# EAGLE design M121B (EAGLE 6.6.0)
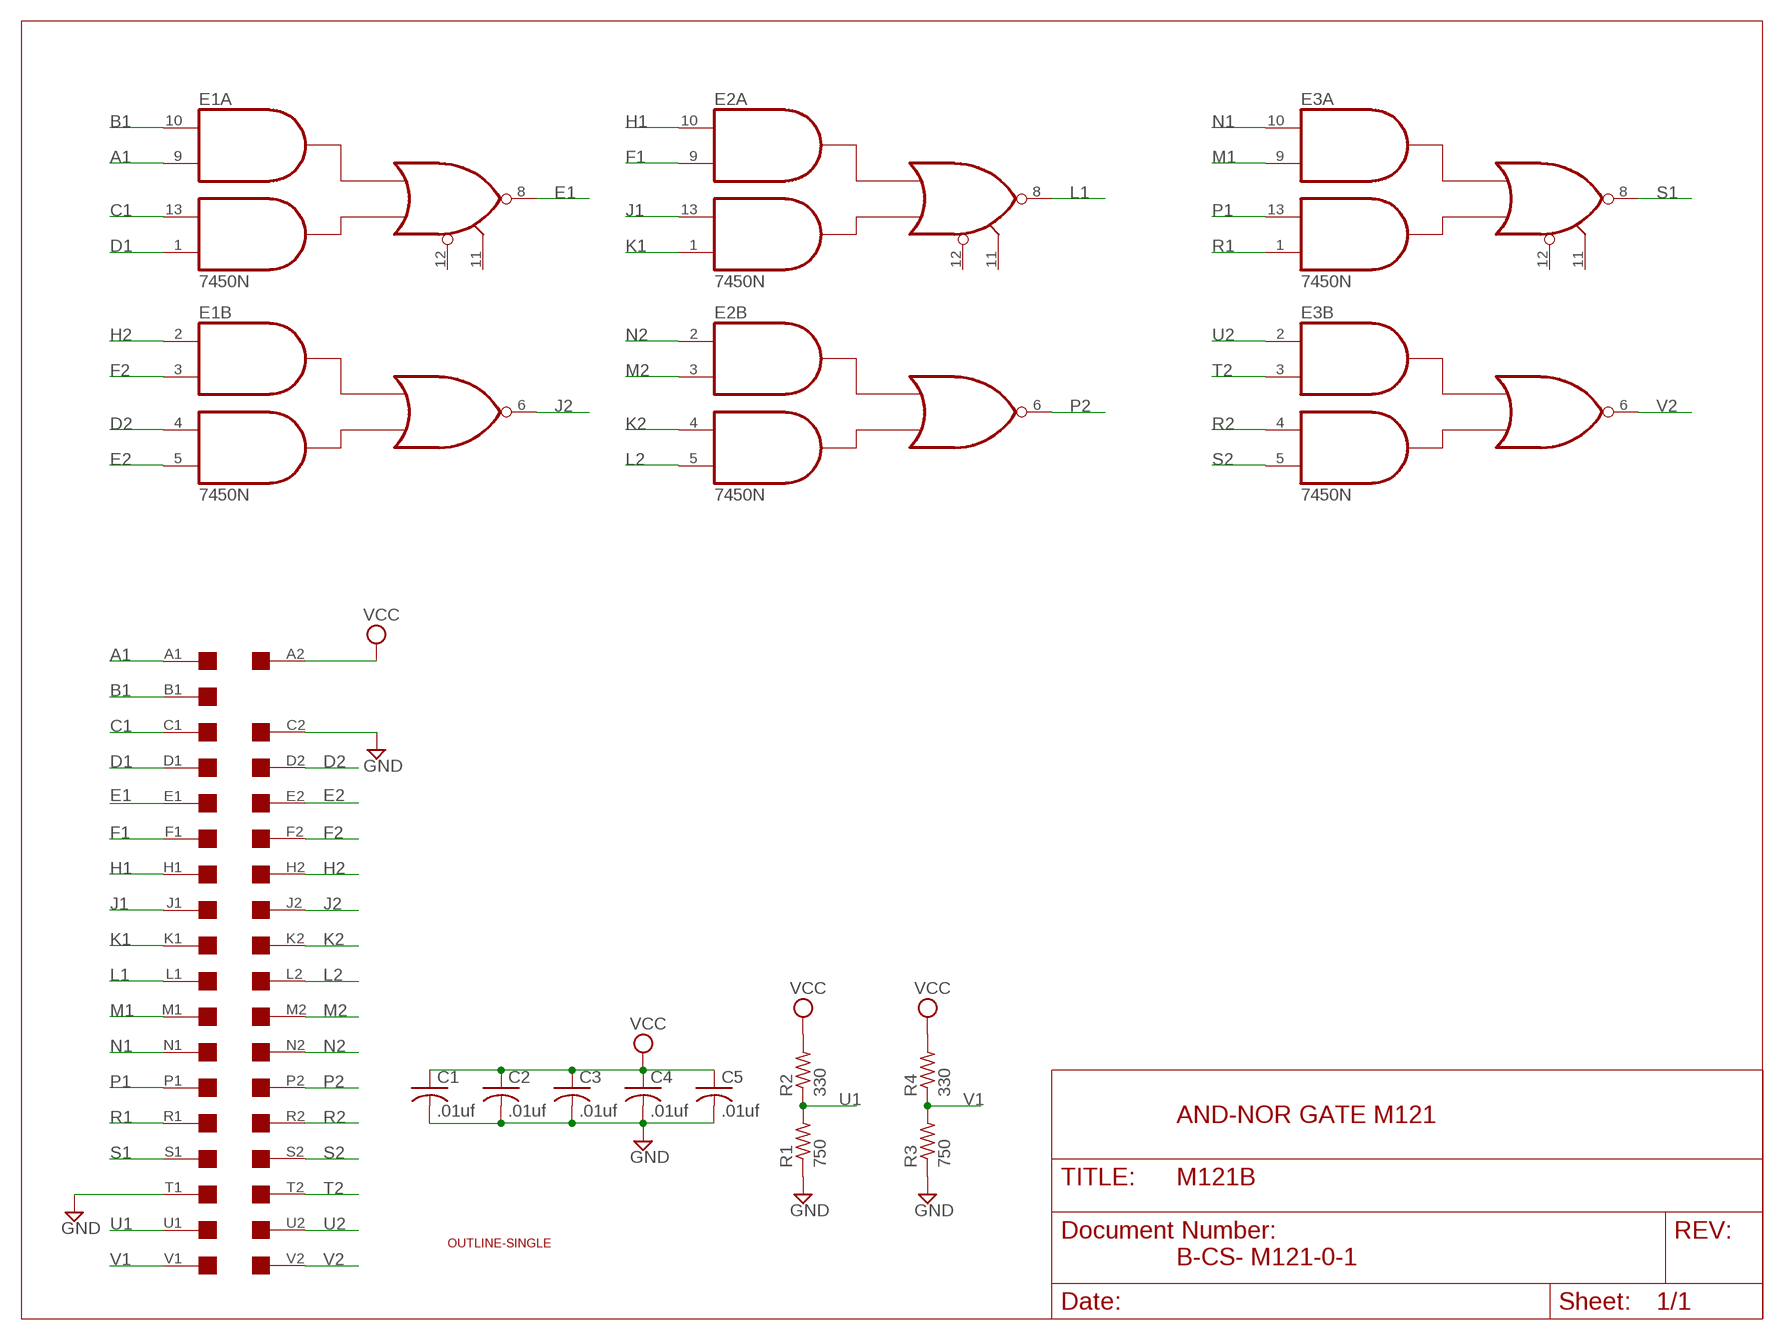
[diagram p0: schematic, sheet 1]

## Parts
C1  .01uf  C-US050-025X075  [C050-025X075]
C2  .01uf  C-US050-025X075  [C050-025X075]
C3  .01uf  C-US050-025X075  [C050-025X075]
C4  .01uf  C-US050-025X075  [C050-025X075]
C5  .01uf  C-US050-025X075  [C050-025X075]
E1  7450N  [DIL14]
E2  7450N  [DIL14]
E3  7450N  [DIL14]
R1  750  R-US_0207/10  [0207/10]
R2  330  R-US_0207/10  [0207/10]
R3  750  R-US_0207/10  [0207/10]
R4  330  R-US_0207/10  [0207/10]
U$1  OUTLINE-SINGLE  [SINGLE]
U$4  SINGLE  [EDGE-CON2]

## Nets
A1: E1.9(A:I2) U$4.A1
B1: E1.10(A:I1) U$4.B1
C1: E1.13(A:I3) U$4.C1
D1: E1.1(A:I4) U$4.D1
D2: E1.4(B:I3) U$4.D2
E1: E1.8(A:O) U$4.E1
E2: E1.5(B:I4) U$4.E2
F1: E2.9(A:I2) U$4.F1
F2: E1.3(B:I2) U$4.F2
GND [Supply]: C1.2 C2.2 C3.2 C4.2 C5.2 R1.1 R3.1 U$4.C2 U$4.T1
H1: E2.10(A:I1) U$4.H1
H2: E1.2(B:I1) U$4.H2
J1: E2.13(A:I3) U$4.J1
J2: E1.6(B:O) U$4.J2
K1: E2.1(A:I4) U$4.K1
K2: E2.4(B:I3) U$4.K2
L1: E2.8(A:O) U$4.L1
L2: E2.5(B:I4) U$4.L2
M1: E3.9(A:I2) U$4.M1
M2: E2.3(B:I2) U$4.M2
N1: E3.10(A:I1) U$4.N1
N2: E2.2(B:I1) U$4.N2
P1: E3.13(A:I3) U$4.P1
P2: E2.6(B:O) U$4.P2
R1: E3.1(A:I4) U$4.R1
R2: E3.4(B:I3) U$4.R2
S1: E3.8(A:O) U$4.S1
S2: E3.5(B:I4) U$4.S2
T2: E3.3(B:I2) U$4.T2
U1: R1.2 R2.1 U$4.U1
U2: E3.2(B:I1) U$4.U2
V1: R3.2 R4.1 U$4.V1
V2: E3.6(B:O) U$4.V2
VCC [Supply]: C1.1 C2.1 C3.1 C4.1 C5.1 R2.2 R4.2 U$4.A2
Unconnected: E1.11(A:I6) E1.12(A:I5) E2.11(A:I6) E2.12(A:I5) E3.11(A:I6) E3.12(A:I5) U$4.B2

## Notes on the sheet
- AND-NOR GATE M121
- B-CS- M121-0-1

## Power pins joined to a net without a drawn wire
GND: E1.7(P:GND) E2.7(P:GND) E3.7(P:GND)
VCC: E1.14(P:VCC) E2.14(P:VCC) E3.14(P:VCC)

## Library data of the parts
C1-C5 = rcl:C-US: CAPACITOR, American symbol
E1-E3 = dec-con:74*50: 4-2-3-2 input AND OR INVERTER gates
R1-R4 = rcl:R-US_: RESISTOR, American symbol
U$1 = dec-con:OUTLINE-*: Board outlines for DEC boards.
U$4 = dec-con:SINGLE: Single-Height DEC board

## Net classes
1 Supply: width 0.813 mm

## Board
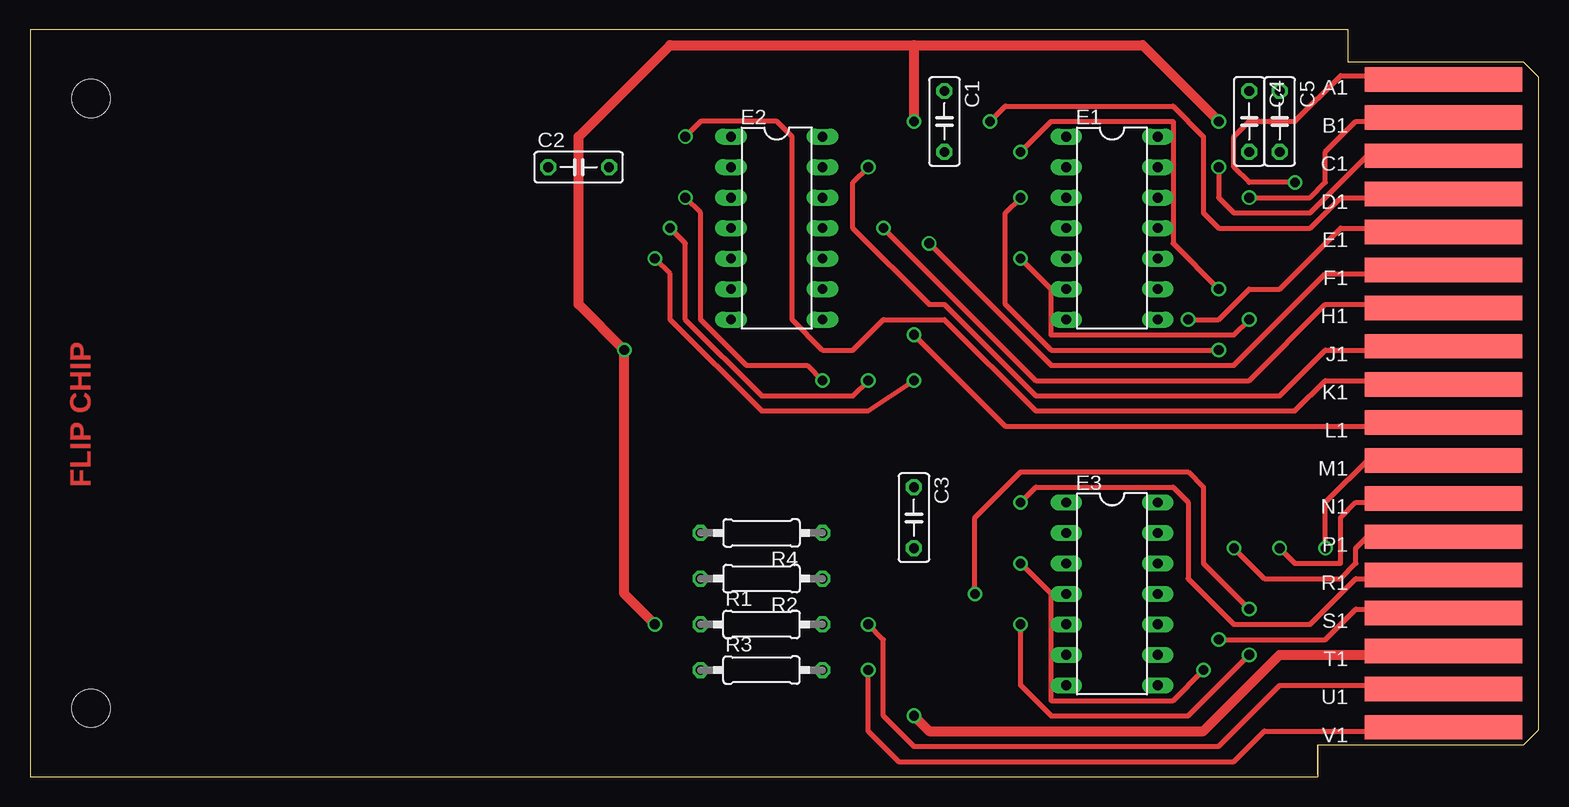
[diagram p1: board, top side]
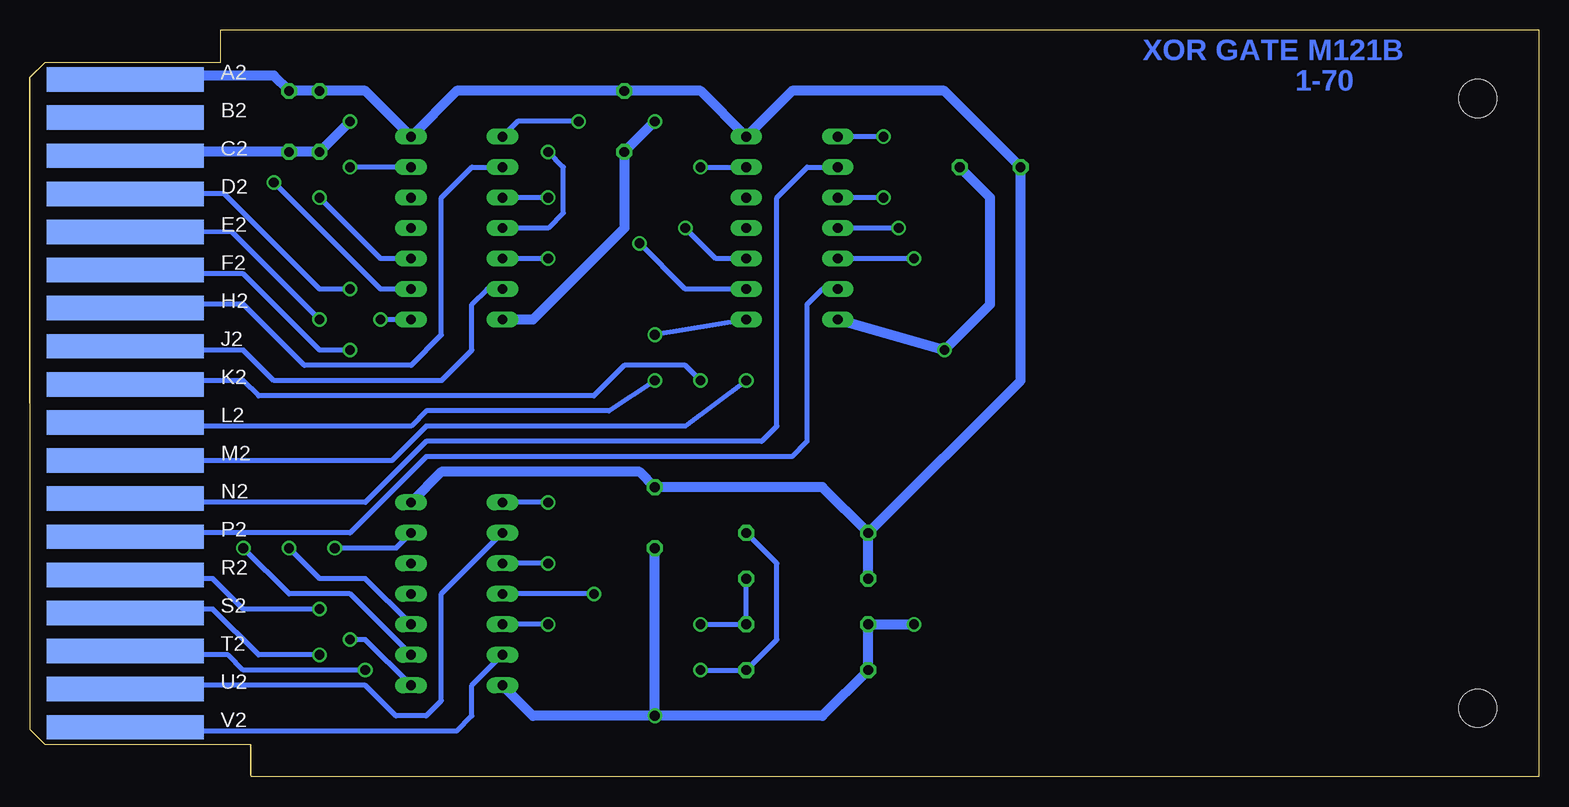
[diagram p2: board, bottom side, seen from below]

Size 125.73 x 62.23 mm. Coordinates in mm from the lower left corner, seen from the top.
Copper layers (1+16): Top 0.035mm / dielectric 1.5mm / Bottom 0.035mm
Design rules "16mils": minimum track width 16mil, minimum drill 32mil, track to track 15mil, track to pad 10mil, pad to pad 10mil, via to via 10mil, smd to smd 10mil, copper to edge 13mil, drill to drill 10mil, minimum pad ring 10mil, minimum via ring 8mil, stop-mask expansion 0mil, vias tented up to drill 0mil, thermal gap 10mil

### Footprints (pad centres in the part's own frame; a part is rotated, then mirrored left to right if it is on the bottom)
C050-025X075 = drill 0.813 octagon: 1 -2.54,0; 2 2.54,0
DIL14 = drill 0.813 long: 1 -7.62,-3.81; 2 -5.08,-3.81; 3 -2.54,-3.81; 4 0,-3.81; 5 2.54,-3.81; 6 5.08,-3.81; 7 7.62,-3.81; 8 7.62,3.81; 9 5.08,3.81; 10 2.54,3.81; 11 0,3.81; 12 -2.54,3.81; 13 -5.08,3.81; 14 -7.62,3.81
0207/10 = drill 0.813 octagon: 1 -5.08,0; 2 5.08,0
SINGLE = hole 3.175: 120.65,56.515; 120.65,5.715
EDGE-CON2 = smd 13.106 x 2.032: A1 7.938,4.128; B1 7.938,7.303; C1 7.938,10.477; D1 7.938,13.652; E1 7.938,16.828; F1 7.938,20.003; H1 7.938,23.177; J1 7.938,26.352; K1 7.938,29.527; L1 7.938,32.703; M1 7.938,35.877; N1 7.938,39.053; P1 7.938,42.227; R1 7.938,45.403; S1 7.938,48.578; T1 7.938,51.752; U1 7.938,54.928; V1 7.938,58.102 | smd 13.106 x 2.032 bottom: A2 7.938,4.128; B2 7.938,7.303; C2 7.938,10.477; D2 7.938,13.652; E2 7.938,16.828; F2 7.938,20.003; H2 7.938,23.177; J2 7.938,26.352; K2 7.938,29.527; L2 7.938,32.703; M2 7.938,35.877; N2 7.938,39.053; P2 7.938,42.227; R2 7.938,45.403; S2 7.938,48.578; T2 7.938,51.752; U2 7.938,54.928; V2 7.938,58.102

### Placement (x,y rotation side)
C1  76.2,54.61 270 top
C2  45.72,50.8 0 top
C3  73.66,21.59 270 top
C4  101.6,54.61 270 top
C5  104.14,54.61 270 top
E1  90.17,45.72 270 top
E2  62.23,45.72 270 top
E3  90.17,15.24 270 top
R1  60.96,12.7 0 top
R2  60.96,16.51 180 top
R3  60.96,8.89 0 top
R4  60.96,20.32 180 top
U$1  125.73,62.23 180 top
U$4  125.73,62.23 180 top

### Tracks (layer width: path | path; a pad name or v marks a point on that pad's centre or on a via)
A1  (via drill 0.81)
  Top 0.406: U$4.A1 112.16,58.02 111.76,58.42 109.22,58.42 105.41,54.61 101.6,54.61 100.33,53.34 100.33,50.8 101.6,49.53 v105.41,49.53
  Bottom 0.406: E1.9 96.52,40.64 v105.41,49.53
B1  (via drill 0.81)
  Top 0.406: U$4.B1 112.05,54.9 111.76,54.61 110.49,54.61 107.95,52.07 107.95,49.53 106.68,48.26 v101.6,48.26
  Bottom 0.406: E1.10 96.52,43.18 v101.6,48.26
C1  (via drill 0.81)
  Top 0.406: U$4.C1 112.09,51.74 111.76,52.07 106.68,46.99 100.33,46.99 99.06,48.26 v99.06,50.8
  Bottom 0.406: E1.13 v99.06,50.8
D1  (via drill 0.81)
  Top 0.406: v80.01,54.61 81.28,55.88 95.25,55.88 97.79,53.34 97.79,46.99 99.06,45.72 106.68,45.72 109.22,48.26 111.76,48.26 112.06,48.56 U$4.D1
  Bottom 0.406: E1.1 85.09,54.61 v80.01,54.61
D2  (via drill 0.81)
  Top 0.406: v82.55,52.07 85.09,54.61 95.25,54.61 95.25,44.45 v99.06,40.64
  Bottom 0.406: E1.4 82.55,45.72 81.28,46.99 81.28,50.8 v82.55,52.07 | U$4.D2 109.53,48.56 101.6,40.64 v99.06,40.64
E1  (via drill 0.81)
  Top 0.406: U$4.E1 112.09,45.39 111.76,45.72 109.22,45.72 104.14,40.64 101.6,40.64 99.06,38.1 v96.52,38.1
  Bottom 0.406: E1.8 v96.52,38.1
E2  (via drill 0.81)
  Top 0.406: v82.55,43.18 85.09,40.64 85.09,36.83 100.33,36.83 v101.6,38.1
  Bottom 0.406: v82.55,43.18 E1.5 | U$4.E2 108.89,45.39 v101.6,38.1
F1  (via drill 0.81)
  Top 0.406: U$4.F1 112.04,42.19 111.76,41.91 107.95,41.91 100.33,34.29 85.09,34.29 v74.93,44.45
  Bottom 0.406: E2.9 71.12,40.64 v74.93,44.45
F2  (via drill 0.81)
  Top 0.406: v82.55,48.26 81.28,46.99 81.28,39.37 85.09,35.56 v99.06,35.56
  Bottom 0.406: v82.55,48.26 E1.3 | U$4.F2 112.04,42.19 111.76,41.91 107.95,41.91 101.6,35.56 v99.06,35.56
GND  (via drill 0.81)
  Top 0.813: U$4.T1 112.09,10.49 111.76,10.16 104.14,10.16 97.79,3.81 74.93,3.81 v73.66,5.08 | v99.06,54.61 92.71,60.96 73.66,60.96 | 73.66,60.96 v73.66,54.61 | 73.66,60.96 53.34,60.96 45.72,53.34 45.72,39.37 v49.53,35.56 49.53,15.24 v52.07,12.7
  Bottom 0.813: v73.66,5.08 C3.2 | v73.66,5.08 59.69,5.08 R3.1 R1.1 v52.07,12.7 | v73.66,5.08 83.82,5.08 E3.7 | U$4.C2 112.09,51.74 111.76,52.07 C5.2 C4.2 v99.06,54.61 | v73.66,54.61 C1.2 76.2,45.72 83.82,38.1 E1.7 | E2.7 v49.53,35.56 45.72,39.37 45.72,48.26 C2.2
H1  (via drill 0.81)
  Top 0.406: U$4.H1 112.09,39.04 111.76,39.37 107.95,39.37 101.6,33.02 83.82,33.02 v71.12,45.72
  Bottom 0.406: E2.10 68.58,43.18 v71.12,45.72
H2
  Bottom 0.406: E1.2 88.9,50.8 91.44,48.26 91.44,36.83 93.98,34.29 102.87,34.29 107.95,39.37 111.76,39.37 112.09,39.04 U$4.H2
J1  (via drill 0.81)
  Top 0.406: U$4.J1 112.09,35.89 111.76,35.56 107.95,35.56 104.14,31.75 83.82,31.75 76.2,39.37 74.93,39.37 68.58,45.72 68.58,49.53 v69.85,50.8
  Bottom 0.406: v69.85,50.8 E2.13
J2
  Bottom 0.406: E1.6 87.63,40.64 88.9,39.37 88.9,35.56 91.44,33.02 105.41,33.02 107.95,35.56 111.76,35.56 112.09,35.89 U$4.J2
K1  (via drill 0.81)
  Top 0.406: v54.61,53.34 55.88,54.61 62.23,54.61 63.5,53.34 63.5,38.1 66.04,35.56 68.58,35.56 71.12,38.1 76.2,38.1 83.82,30.48 105.41,30.48 107.95,33.02 111.76,33.02 112.06,32.72 U$4.K1
  Bottom 0.406: v54.61,53.34 E2.1
K2  (via drill 0.81)
  Top 0.406: v53.34,45.72 54.61,44.45 54.61,38.1 60.96,31.75 68.58,31.75 v69.85,33.02
  Bottom 0.406: v53.34,45.72 E2.4 | v69.85,33.02 71.12,34.29 76.2,34.29 78.74,31.75 106.68,31.75 107.95,33.02 111.76,33.02 112.06,32.72 U$4.K2
L1  (via drill 0.81)
  Top 0.406: U$4.L1 112.09,29.54 111.76,29.21 81.28,29.21 v73.66,36.83
  Bottom 0.406: E2.8 v73.66,36.83
L2  (via drill 0.81)
  Top 0.406: v52.07,43.18 53.34,41.91 53.34,38.1 60.96,30.48 69.85,30.48 v73.66,33.02
  Bottom 0.406: v52.07,43.18 E2.5 | U$4.L2 112.09,29.54 111.76,29.21 93.98,29.21 92.71,30.48 77.47,30.48 v73.66,33.02
M1  (via drill 0.81)
  Top 0.406: U$4.M1 113.97,26.34 113.03,26.67 111.76,26.67 107.95,22.86 v107.95,19.05
  Bottom 0.406: E3.9 99.06,15.24 104.14,15.24 v107.95,19.05
M2  (via drill 0.81)
  Top 0.406: v54.61,48.26 55.88,46.99 55.88,38.1 59.69,34.29 64.77,34.29 v66.04,33.02
  Bottom 0.406: v54.61,48.26 E2.3 | U$4.M2 95.58,26.34 92.71,29.21 71.12,29.21 v66.04,33.02
N1  (via drill 0.81)
  Top 0.406: U$4.N1 112.09,23.19 111.76,22.86 110.49,22.86 109.22,21.59 109.22,17.78 105.41,17.78 v104.14,19.05
  Bottom 0.406: E3.10 97.79,16.51 101.6,16.51 v104.14,19.05
N2
  Bottom 0.406: E2.2 60.96,50.8 63.5,48.26 63.5,29.21 64.77,27.94 92.71,27.94 97.46,23.19 97.79,22.86 111.76,22.86 112.09,23.19 U$4.N2
P1  (via drill 0.81)
  Top 0.406: U$4.P1 112.09,19.99 111.76,20.32 110.49,19.05 110.49,17.78 109.22,16.51 102.87,16.51 v100.33,19.05
  Bottom 0.406: E3.13 95.25,19.05 v100.33,19.05
P2
  Bottom 0.406: E2.6 59.69,40.64 60.96,39.37 60.96,27.94 62.23,26.67 92.71,26.67 99.06,20.32 111.76,20.32 112.09,19.99 U$4.P2
R1  (via drill 0.81)
  Top 0.406: v82.55,22.86 83.82,24.13 95.25,24.13 96.52,22.86 96.52,16.51 100.33,12.7 106.68,12.7 110.49,16.51 111.76,16.51 112.09,16.84 U$4.R1
  Bottom 0.406: v82.55,22.86 E3.1
R2  (via drill 0.81)
  Top 0.406: v78.74,15.24 78.74,21.59 82.55,25.4 96.52,25.4 97.79,24.13 97.79,17.78 v101.6,13.97
  Bottom 0.406: v78.74,15.24 E3.4 | U$4.R2 112.09,16.84 111.76,16.51 110.49,16.51 107.95,13.97 v101.6,13.97
S1  (via drill 0.81)
  Top 0.406: U$4.S1 112.06,13.66 111.76,13.97 110.49,13.97 107.95,11.43 v99.06,11.43
  Bottom 0.406: v99.06,11.43 97.79,11.43 E3.8
S2  (via drill 0.81)
  Top 0.406: v82.55,12.7 82.55,7.62 85.09,5.08 96.52,5.08 v101.6,10.16
  Bottom 0.406: v82.55,12.7 E3.5 | U$4.S2 112.06,13.66 111.76,13.97 110.49,13.97 106.68,10.16 v101.6,10.16
T2  (via drill 0.81)
  Top 0.406: v82.55,17.78 85.09,15.24 85.09,6.35 95.25,6.35 v97.79,8.89
  Bottom 0.406: v82.55,17.78 E3.3 | U$4.T2 112.09,10.49 111.76,10.16 109.22,10.16 107.95,8.89 v97.79,8.89
U1  (via drill 0.81)
  Top 0.406: U$4.U1 112.12,7.26 111.76,7.62 104.14,7.62 99.06,2.54 73.66,2.54 71.12,5.08 71.12,11.43 v69.85,12.7
  Bottom 0.406: R2.1 R1.2 v69.85,12.7
U2
  Bottom 0.406: E3.2 91.44,15.24 91.44,6.35 92.71,5.08 95.25,5.08 97.79,7.62 111.76,7.62 112.12,7.26 U$4.U2
V1  (via drill 0.81)
  Top 0.406: U$4.V1 112.15,4.2 111.76,3.81 102.87,3.81 100.33,1.27 72.39,1.27 69.85,3.81 v69.85,8.89
  Bottom 0.406: R4.1 63.5,17.78 63.5,11.43 R3.2 v69.85,8.89
V2
  Bottom 0.406: U$4.V2 112.15,4.2 111.76,3.81 90.17,3.81 88.9,5.08 88.9,7.62 E3.6
VCC
  Bottom 0.813: U$4.A2 112.16,58.02 111.76,58.42 105.41,58.42 C5.1 C4.1 97.79,57.15 E1.14 90.17,57.15 C1.1 69.85,57.15 E2.14 62.23,57.15 49.53,57.15 C2.1 43.18,33.02 R4.2 | R2.2 R4.2 | R4.2 59.69,24.13 C3.1 74.93,25.4 91.44,25.4 E3.14

### Text on the board
Top: FLIP CHIP
Bottom: XOR GATE M121B | 1-70